# Altium project LCRBoard.PrjPcb
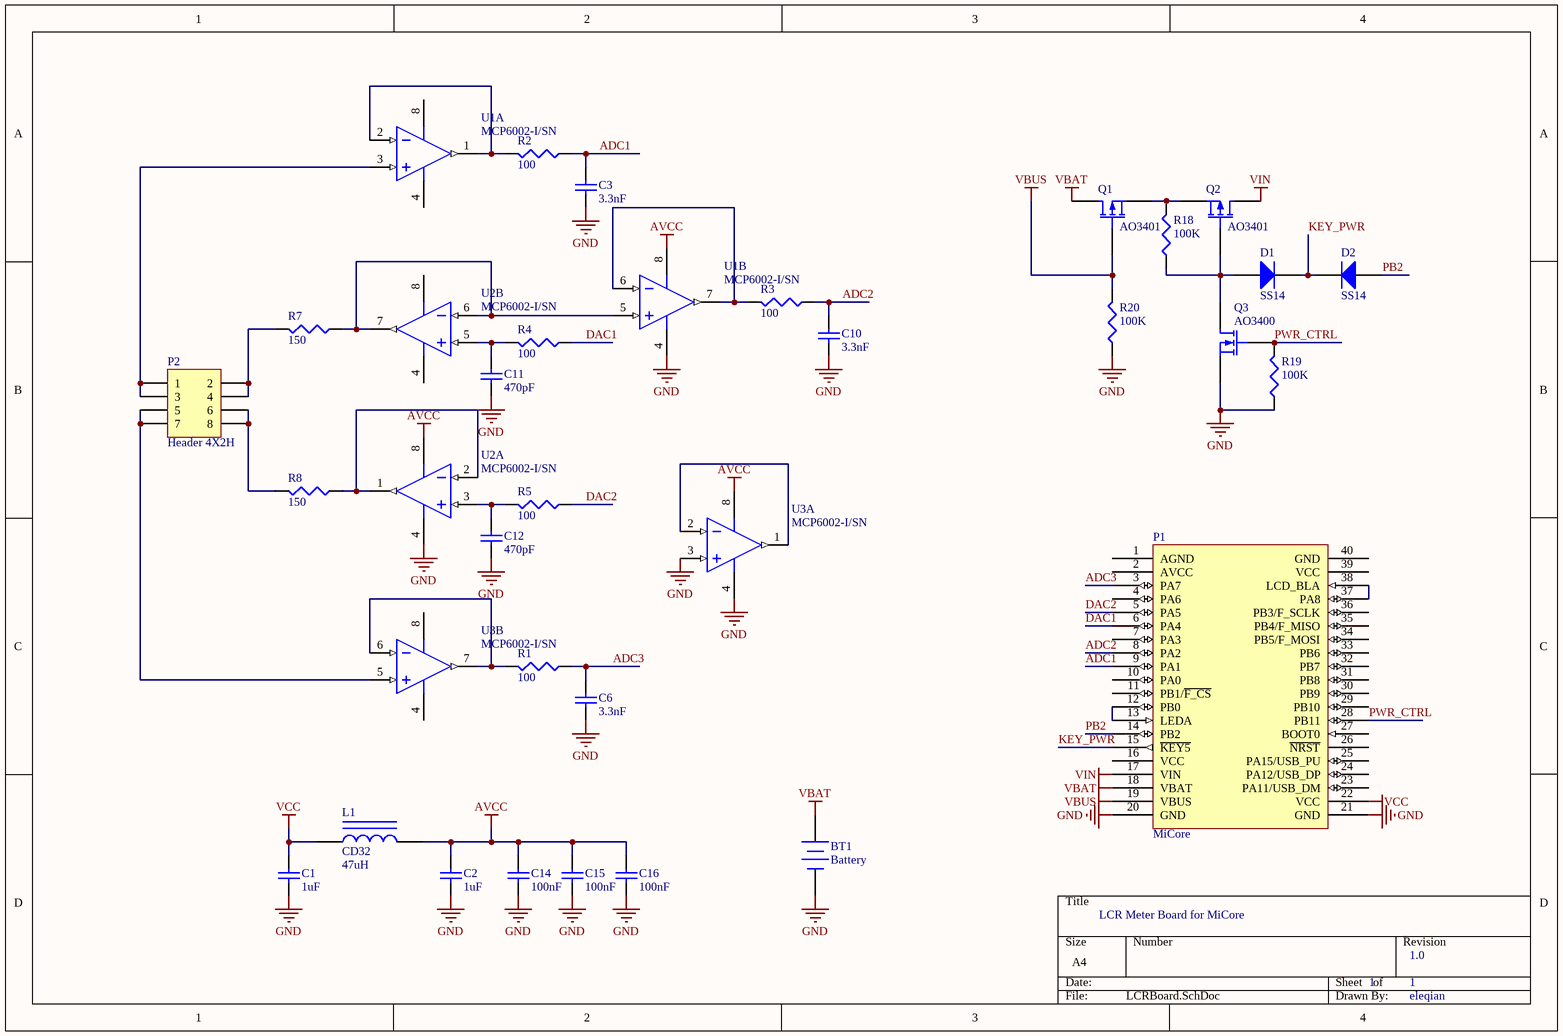
[diagram p0: LCRBoard.SchDoc]
1 sheet, 32 parts. Net scope: global (net labels, ports and power ports of the same name join across sheets).
Board file: LCRBoard.PcbDoc

## Sheet LCRBoard.SchDoc: LCR Meter Board for MiCore
size A4; DrawnBy: eleqian; Revision: 1.0; SheetNumber: 1; SheetTotal: 1

### Parts
BT1  Battery  [BAT-2]
C1  value 1uF  [0603C]  (hidden comment: Cap)
C2  value 1uF  [0603C]  (hidden comment: Cap)
C3  value 3.3nF  [0603C]  (hidden comment: Cap)
C6  value 3.3nF  [0603C]  (hidden comment: Cap)
C10  value 3.3nF  [0603C]  (hidden comment: Cap)
C11  value 470pF  [0603C]  (hidden comment: Cap)
C12  value 470pF  [0603C]  (hidden comment: Cap)
C14  value 100nF  [0603C]  (hidden comment: Cap)
C15  value 100nF  [0603C]  (hidden comment: Cap)
C16  value 100nF  [0603C]  (hidden comment: Cap)
D1  SS14  [0805D]
D2  SS14  [0805D]
L1  CD32  value 47uH  [CD32]
P1  MiCore  [MICORE]
P2  Header 4X2H  [HDR2X4H]
Q1  AO3401  [SOT-23]
Q2  AO3401  [SOT-23]
Q3  AO3400  [SOT-23]
R1  value 100  [0603R]  (hidden comment: Res3)
R2  value 100  [0603R]  (hidden comment: Res3)
R3  value 100  [0603R]  (hidden comment: Res3)
R4  value 100  [0603R]  (hidden comment: Res3)
R5  value 100  [0603R]  (hidden comment: Res3)
R7  value 150  [0603R]  (hidden comment: Res3)
R8  value 150  [0603R]  (hidden comment: Res3)
R18  value 100K  [0603R]  (hidden comment: Res3)
R19  value 100K  [0603R]  (hidden comment: Res3)
R20  value 100K  [0603R]  (hidden comment: Res3)
U1  MCP6002-I/SN  [SOIC-SN8_N]  (parts A,B of 2)
U2  MCP6002-I/SN  [SOIC-SN8_N]  (parts A,B of 2)
U3  MCP6002-I/SN  [SOIC-SN8_N]  (parts A,B of 2)

### Nets
AVCC: C2.2 C14.2 C15.2 C16.2 L1.2 U1.8(VDD) U2.8(VDD) U3.8(VDD)
GND: BT1.2(-) C1.1 C2.1 C3.2 C6.2 C10.2 C11.2 C12.2 C14.1 C15.1 C16.1 P1.20(GND) P1.21(GND) Q3.3(S) R19.1 R20.1 U1.4(VSS) U2.4(VSS) U3.3(VINA+) U3.4(VSS)
VBAT: BT1.1(+) P1.18(VBAT) Q1.1(D)
VBUS: P1.19(VBUS) Q1.2(G) R20.2
VCC: C1.2 L1.1 P1.22(VCC)
VIN: P1.17(VIN) Q2.1(D)
ADC1: C3.1 P1.9(PA1) R2.1
ADC2: C10.1 P1.8(PA2) R3.1
ADC3: C6.1 P1.3(PA7) R1.1
DAC1: P1.6(PA4) R4.1
DAC2: P1.5(PA5) R5.1
KEY_PWR: D1.2(K) D2.2(K) P1.15(~{KEY5})
PB2: D2.1(A) P1.14(PB2)
PWR_CTRL: P1.28(PB11) Q3.2(G) R19.2
NetC11_1: C11.1 R4.2 U2.5(VINB+)
NetC12_1: C12.1 R5.2 U2.3(VINA+)
NetD1_1: D1.1(A) Q2.2(G) Q3.1(D) R18.1
NetP1_12: P1.12(PB0) P1.13(LEDA)
NetP1_37: P1.37(PA8) P1.38(LCD_BLA)
NetP2_1: P2.1 P2.3 U1.3(VINA+)
NetP2_2: P2.2 P2.4 R7.2
NetP2_5: P2.5 P2.7 U3.5(VINB+)
NetP2_6: P2.6 P2.8 R8.2
NetQ1_3: Q1.3(S) Q2.3(S) R18.2
NetR1_2: R1.2 U3.6(VINB-) U3.7(VOUTB)
NetR2_2: R2.2 U1.1(VOUTA) U1.2(VINA-)
NetR3_2: R3.2 U1.6(VINB-) U1.7(VOUTB)
NetR7_1: R7.1 U1.5(VINB+) U2.6(VINB-) U2.7(VOUTB)
NetR8_1: R8.1 U2.1(VOUTA) U2.2(VINA-)
NetU3_1: U3.1(VOUTA) U3.2(VINA-)

Not connected (* = marked no-connect by the designer): P1 1(AGND) 2(AVCC) 4(PA6) 7(PA3) 10(PA0) 11(PB1/~{F_CS}) 16(VCC) 23(PA11/USB_DM) 24(PA12/USB_DP) 25(PA15/USB_PU) 26(~{NRST}) 27(BOOT0) 29(PB10) 30(PB9) 31(PB8) 32(PB7) 33(PB6) 34(PB5/F_MOSI) 35(PB4/F_MISO) 36(PB3/F_SCLK) 39(VCC) 40(GND)

### Library data of the parts
BT1 = Battery: Multicell Battery; Published: 24-Mar-1999; LatestRevisionDate: 17-Jul-2002; LatestRevisionNote: Re-released for DXP Platform.; PackageReference: BAT-2; Publisher: Altium Limited; PackageDescription: Battery; 2 Leads
C1-C3 C6 C10-C12 C14-C16 = Cap: Capacitor; Published: 8-Jun-2000; LatestRevisionDate: 17-Jul-2002; LatestRevisionNote: Re-released for DXP Platform.; PackageReference: RAD-0.3; Publisher: Altium Limited; PackageDescription: Radial Cap, Thru-Hole; 2 Leads; 0.3 in Pin Spacing
D1 D2 = Diode: Default Diode; Published: 8-Jun-2000; LatestRevisionDate: 17-Jul-2002; LatestRevisionNote: Re-released for DXP Platform.; PackageVersion: Sep-1996; PackageReference: SMC; Publisher: Altium Limited; Code_JEDEC: DO-214-AB
L1 = Inductor Iron: Magnetic-Core Inductor; Published: 24-Mar-1999; LatestRevisionDate: 17-Jul-2002; LatestRevisionNote: Re-released for DXP Platform.; PackageReference: AXIAL-0.9; Publisher: Altium Limited; PackageDescription: Axial Device, Thru-Hole; 2 Leads; 0.9 in Pin Spacing
P1 = MiCo: MiCore核心板
P2 = Header 4X2H: Header, 4-Pin, Dual row, Right Angle; LatestRevisionDate: 17-Jul-2002; LatestRevisionNote: Re-released for DXP Platform.; Publisher: Altium Limited
Q1 Q2 = MOSFET-P: P-Channel MOSFET; pin to pad: 1>3 2>1 3>2; Published: 8-Jun-2000; LatestRevisionDate: 17-Jul-2002; LatestRevisionNote: Re-released for DXP Platform.; PackageVersion: 1995/1996; PackageReference: E3; Publisher: Altium Limited
Q3 = MOSFET-N: N-Channel MOSFET; pin to pad: 1>3 2>1 3>2; Published: 8-Jun-2000; LatestRevisionDate: 17-Jul-2002; LatestRevisionNote: Re-released for DXP Platform.; PackageVersion: 1995/1996; PackageReference: E3; Publisher: Altium Limited
R1-R5 R7 R8 R18-R20 = Res3: Resistor; Published: 8-Jun-2000; LatestRevisionDate: 29-May-2009; LatestRevisionNote: IPC-7351 Footprint Added.; PackageReference: J1-0603; Publisher: Altium Limited; PackageDescription: Chip Resistor
U1-U3 = MCP6002-I/SN: 1 MHz, Low-Power Operational Amplifier, 8-Pin SOIC, Industrial Temperature; Published: 29-Jan-2009; LatestRevisionDate: 02-Dec-2009; LatestRevisionNote: Updated to datasheet revision J, Nov-2009; DatasheetVersion: revJ, Nov-2009; PackageVersion: revBB, Aug-2009; PackageReference: SOIC-SN8; Publisher: Altium Limited; PackageDescription: 8-Lead Plastic Small Outline (SN) - Narrow, 3.90mm Body [SOIC]; Supplier 1: Digi-Key; Supplier Part Number 1: MCP6002-I/SN-ND; Supplier 2: Farnell; Supplier Part Number 2: 1292246; Code_JEDEC: MS-012; Code_IPC: SOIC127P600-8; ComponentLink1Description: Datasheet; ComponentLink1URL: http://ww1.microchip.com/downloads/en/DeviceDoc/21733j.pdf; ComponentLink2Description: Packaging Specification; ComponentLink2URL: http://www.microchip.com/stellent/groups/techpub_sg/documents/packagingspec/en012702.pdf; ComponentLink3Description: Microchip.com Home; ComponentLink3URL: http://www.microchip.com/